# Altium project 单车驱动.PrjPcb
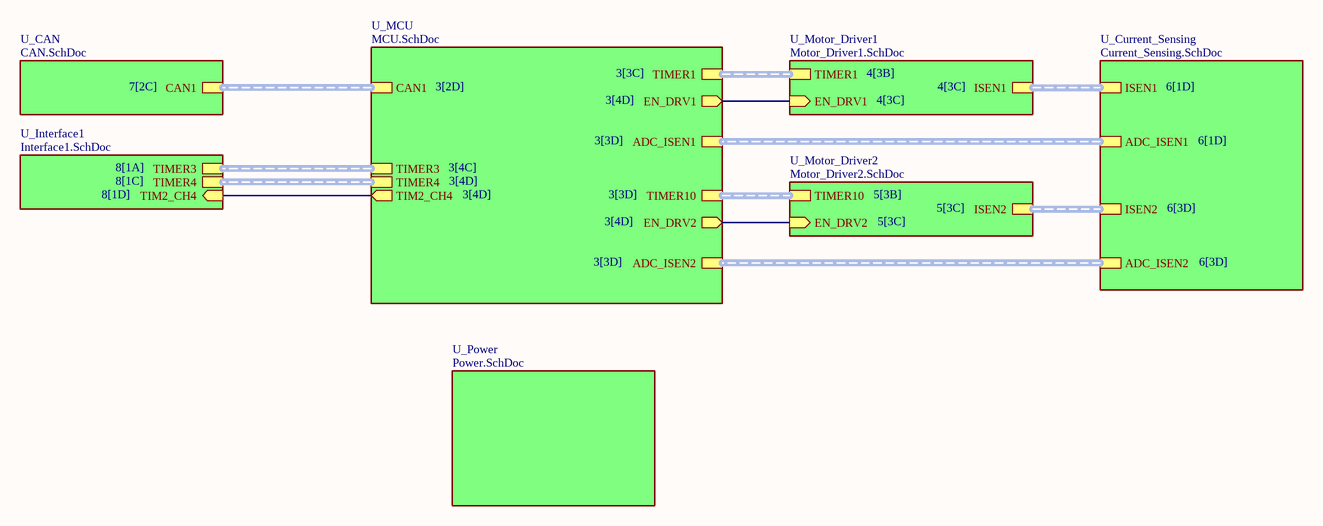
[diagram p0: Top_Level.SchDoc]
6 sheets, 175 parts. Net scope: hierarchical (ports join the sheet entries above them; power ports are global).
Board file: PCB1.PcbDoc
Sheets:
  Top_Level.SchDoc
    U_MCU = MCU.SchDoc
    U_CAN = CAN.SchDoc
    U_Current_Sensing = Current_Sensing.SchDoc
    U_Motor_Driver2 = Motor_Driver2.SchDoc
    U_Power = Power.SchDoc

## Sheet Top_Level.SchDoc
size A4; SheetNumber: 1; SheetTotal: 8

### Sub-sheets
U_CAN = CAN.SchDoc: CAN1 (harness CAN1)
U_Current_Sensing = Current_Sensing.SchDoc: ISEN1 (harness ISEN1), ISEN2 (harness ISEN2), ADC_ISEN1 (harness ADC_ISEN1), ADC_ISEN2 (harness ADC_ISEN2)
U_Interface1 = Interface1.SchDoc (file not in this document): TIMER4 (harness TIMER4), TIMER3 (harness TIMER3), TIM2_CH4 (in)
U_MCU = MCU.SchDoc: TIMER1 (harness TIMER1), TIMER10 (harness TIMER10), TIMER4 (harness TIMER4), TIMER3 (harness TIMER3), CAN1 (harness CAN1), ADC_ISEN1 (harness ADC_ISEN1), ADC_ISEN2 (harness ADC_ISEN2), TIM2_CH4 (out), EN_DRV1 (out), EN_DRV2 (out)
U_Motor_Driver1 = Motor_Driver1.SchDoc (file not in this document): TIMER1 (harness TIMER1), ISEN1 (harness ISEN1), EN_DRV1 (in)
U_Motor_Driver2 = Motor_Driver2.SchDoc: TIMER10 (harness TIMER10), ISEN2 (harness ISEN2), EN_DRV2 (in)
U_Power = Power.SchDoc: no entries

### Nets
EN_DRV1: sheet U_MCU/EN_DRV1, sheet U_Motor_Driver1/EN_DRV1
EN_DRV2: sheet U_MCU/EN_DRV2, sheet U_Motor_Driver2/EN_DRV2
TIM2_CH4: sheet U_MCU/TIM2_CH4, sheet U_Interface1/TIM2_CH4

### Buses and harness runs
harness sheet U_CAN/CAN1 = sheet U_MCU/CAN1
harness sheet U_Current_Sensing/ADC_ISEN1 = sheet U_MCU/ADC_ISEN1
harness sheet U_Current_Sensing/ADC_ISEN2 = sheet U_MCU/ADC_ISEN2
harness sheet U_Current_Sensing/ISEN1 = sheet U_Motor_Driver1/ISEN1
harness sheet U_Current_Sensing/ISEN2 = sheet U_Motor_Driver2/ISEN2
harness sheet U_Interface1/TIMER3 = sheet U_MCU/TIMER3
harness sheet U_Interface1/TIMER4 = sheet U_MCU/TIMER4
harness sheet U_MCU/TIMER1 = sheet U_Motor_Driver1/TIMER1
harness sheet U_MCU/TIMER10 = sheet U_Motor_Driver2/TIMER10

## Sheet MCU.SchDoc
size A4; SheetNumber: 3; SheetTotal: 8
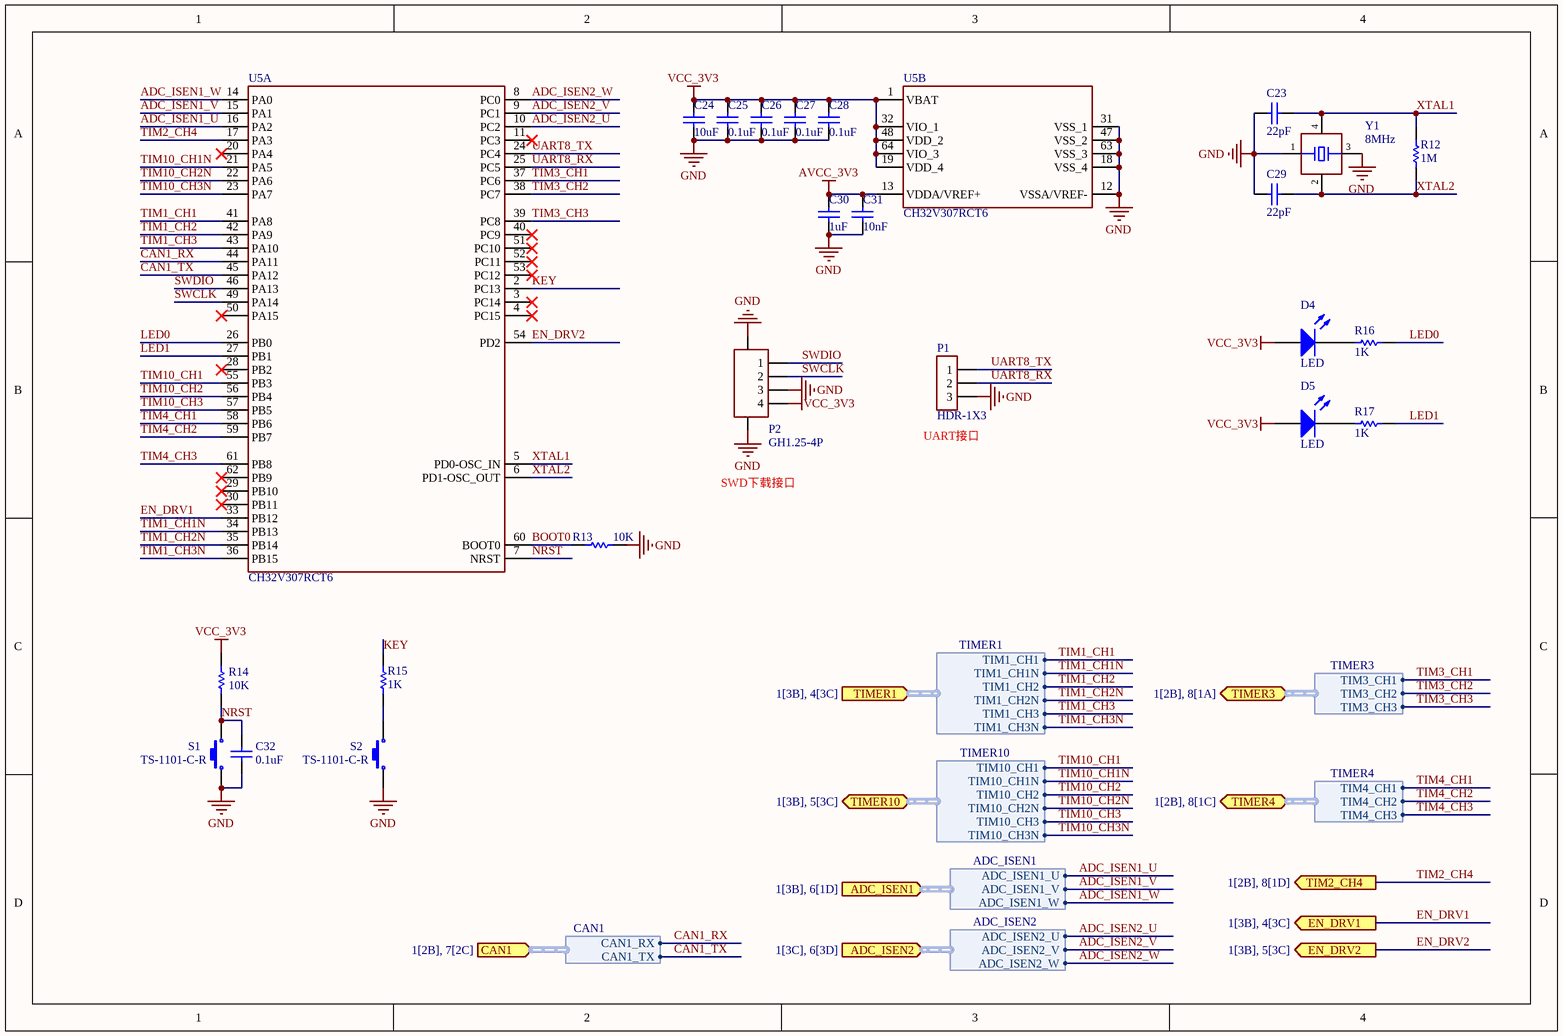
[diagram p1: MCU.SchDoc]

### Parts
C23  22pF  [C0603_NS]
C24  10uF  [C0603_NS]
C25  0.1uF  [C0603_NS]
C26  0.1uF  [C0603_NS]
C27  0.1uF  [C0603_NS]
C28  0.1uF  [C0603_NS]
C29  22pF  [C0603_NS]
C30  1uF  [C0603_NS]
C31  10nF  [C0603_NS]
C32  0.1uF  [C0603_NS]
D4  LED  [LED0603_NS]
D5  LED  [LED0603_NS]
P1  HDR-1X3  [HDR2.54-WI-3P]
P2  GH1.25-4P  [A1257WR-S-4P]
R12  1M  [R0603_NS]
R13  10K  [R0603_NS]
R14  10K  [R0603_NS]
R15  1K  [R0603_NS]
R16  1K  [R0603_NS]
R17  1K  [R0603_NS]
S1  TS-1101-C-R  [TS-1101]
S2  TS-1101-C-R  [TS-1101]
U5  CH32V307RCT6  [LQFP64_N]  (parts A,B of 2)
Y1  8MHz  [SMD-3225-4P]

### Ports
ADC_ISEN1 (in, harness ADC_ISEN1, see 1[3B], 6[1D]), ADC_ISEN2 (in, harness ADC_ISEN2, see 1[3C], 6[3D]), CAN1 (in, harness CAN1, see 1[2B], 7[2C]), EN_DRV1 (out, see 1[3B], 4[3C]), EN_DRV2 (out, see 1[3B], 5[3C]), TIM2_CH4 (out, see 1[2B], 8[1D]), TIMER1 (in, harness TIMER1, see 1[3B], 4[3C]), TIMER3 (bidir, harness TIMER3, see 1[2B], 8[1A]), TIMER4 (bidir, harness TIMER4, see 1[2B], 8[1C]), TIMER10 (bidir, harness TIMER10, see 1[3B], 5[3C])

### Harnesses
TIMER1: TIM1_CH1, TIM1_CH2, TIM1_CH3, TIM1_CH1N, TIM1_CH2N, TIM1_CH3N
TIMER10: TIM10_CH1N, TIM10_CH2N, TIM10_CH3N, TIM10_CH1, TIM10_CH2, TIM10_CH3
TIMER4: TIM4_CH1, TIM4_CH2, TIM4_CH3
TIMER3: TIM3_CH1, TIM3_CH2, TIM3_CH3
CAN1: CAN1_RX, CAN1_TX
ADC_ISEN1: ADC_ISEN1_W, ADC_ISEN1_V, ADC_ISEN1_U
ADC_ISEN2: ADC_ISEN2_W, ADC_ISEN2_V, ADC_ISEN2_U

### Nets
AVCC_3V3: C30.2 C31.2 U5.13(VDDA/VREF+)
GND: C23.1 C24.1 C25.1 C26.1 C27.1 C28.1 C29.1 C30.1 C31.1 C32.1 P1.3 P2.0 P2.3 R13.2 S1.1 S2.1 U5.12(VSSA/VREF-) U5.18(VSS_4) U5.31(VSS_1) U5.47(VSS_2) U5.63(VSS_3) Y1.1 Y1.3
VCC_3V3: C24.2 C25.2 C26.2 C27.2 C28.2 D4.1(A) D5.1(A) P2.4 R14.1 U5.1(VBAT) U5.19(VDD_4) U5.32(VIO_1) U5.48(VDD_2) U5.64(VIO_3)
ADC_ISEN1_U: U5.16(PA2) ; port ADC_ISEN1.ADC_ISEN1_U
ADC_ISEN1_V: U5.15(PA1) ; port ADC_ISEN1.ADC_ISEN1_V
ADC_ISEN1_W: U5.14(PA0) ; port ADC_ISEN1.ADC_ISEN1_W
ADC_ISEN2_U: U5.10(PC2) ; port ADC_ISEN2.ADC_ISEN2_U
ADC_ISEN2_V: U5.9(PC1) ; port ADC_ISEN2.ADC_ISEN2_V
ADC_ISEN2_W: U5.8(PC0) ; port ADC_ISEN2.ADC_ISEN2_W
BOOT0: R13.1 U5.60(BOOT0)
CAN1_RX: U5.44(PA11) ; port CAN1.CAN1_RX
CAN1_TX: U5.45(PA12) ; port CAN1.CAN1_TX
EN_DRV1: U5.33(PB12) ; port EN_DRV1
EN_DRV2: U5.54(PD2) ; port EN_DRV2
KEY: R15.2 U5.2(PC13)
LED0: R16.2 U5.26(PB0)
LED1: R17.2 U5.27(PB1)
NRST: C32.2 R14.2 S1.2 U5.7(NRST)
SWCLK: P2.2 U5.49(PA14)
SWDIO: P2.1 U5.46(PA13)
TIM1_CH1: U5.41(PA8) ; port TIMER1.TIM1_CH1
TIM1_CH1N: U5.34(PB13) ; port TIMER1.TIM1_CH1N
TIM1_CH2: U5.42(PA9) ; port TIMER1.TIM1_CH2
TIM1_CH2N: U5.35(PB14) ; port TIMER1.TIM1_CH2N
TIM1_CH3: U5.43(PA10) ; port TIMER1.TIM1_CH3
TIM1_CH3N: U5.36(PB15) ; port TIMER1.TIM1_CH3N
TIM2_CH4: U5.17(PA3) ; port TIM2_CH4
TIM3_CH1: U5.37(PC6) ; port TIMER3.TIM3_CH1
TIM3_CH2: U5.38(PC7) ; port TIMER3.TIM3_CH2
TIM3_CH3: U5.39(PC8) ; port TIMER3.TIM3_CH3
TIM4_CH1: U5.58(PB6) ; port TIMER4.TIM4_CH1
TIM4_CH2: U5.59(PB7) ; port TIMER4.TIM4_CH2
TIM4_CH3: U5.61(PB8) ; port TIMER4.TIM4_CH3
TIM10_CH1: U5.55(PB3) ; port TIMER10.TIM10_CH1
TIM10_CH1N: U5.21(PA5) ; port TIMER10.TIM10_CH1N
TIM10_CH2: U5.56(PB4) ; port TIMER10.TIM10_CH2
TIM10_CH2N: U5.22(PA6) ; port TIMER10.TIM10_CH2N
TIM10_CH3: U5.57(PB5) ; port TIMER10.TIM10_CH3
TIM10_CH3N: U5.23(PA7) ; port TIMER10.TIM10_CH3N
UART8_RX: P1.2 U5.25(PC5)
UART8_TX: P1.1 U5.24(PC4)
XTAL1: C23.2 R12.2 U5.5(PD0-OSC_IN) Y1.4
XTAL2: C29.2 R12.1 U5.6(PD1-OSC_OUT) Y1.2
NetD4_2: D4.2(K) R16.1
NetD5_2: D5.2(K) R17.1
NetR15_1: R15.1 S2.2

Not connected (* = marked no-connect by the designer): U5 3(PC14)* 4(PC15)* 11(PC3)* 20(PA4)* 28(PB2)* 29(PB10)* 30(PB11)* 40(PC9)* 50(PA15)* 51(PC10)* 52(PC11)* 53(PC12)* 62(PB9)*

### Notes on the sheet
- (near P1) UART接口
- SWD下载接口

### Library data of the parts
C23-C32 = Cap: Capacitor
  C23 C29: Published: 8-Jun-2000; LatestRevisionDate: 17-Jul-2002; LatestRevisionNote: Re-released for DXP Platform.; PackageReference: RAD-0.3; Publisher: Altium Limited; PackageDescription: Radial Cap, Thru-Hole; 2 Leads; 0.3 in Pin Spacing; Value: 22pF
D4 D5 = LED0: Typical INFRARED GaAs LED
P2 = Header4
R12-R17 = Res1: Resistor
S1 S2 = SW
Y1 = XTAL

## Sheet CAN.SchDoc
size A4; SheetNumber: 7; SheetTotal: 8
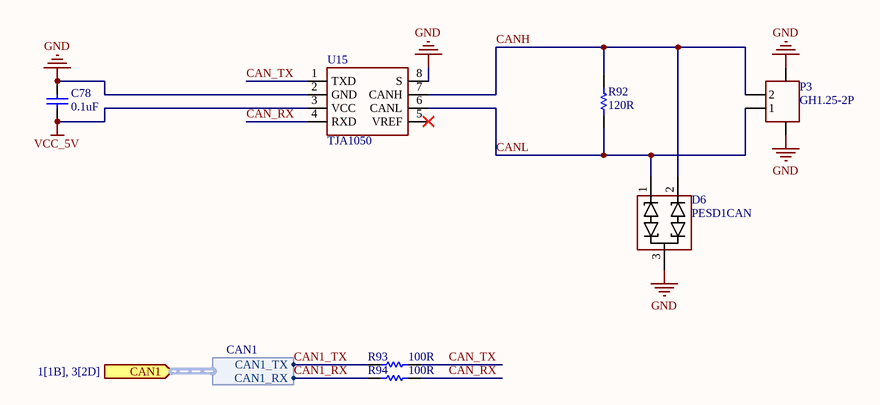
[diagram p2: CAN.SchDoc]

### Parts
C78  0.1uF  [C0603_NS]
D6  PESD1CAN  [SOT23-3N]
P3  GH1.25-2P  [A1257WR-S-2P]
R92  120R  [R0603_NS]
R93  100R  [R0603_NS]
R94  100R  [R0603_NS]
U15  TJA1050  [SOP8_N]

### Ports
CAN1 (in, harness CAN1, see 1[1B], 3[2D])

### Harnesses
CAN1: CAN1_RX, CAN1_TX

### Nets
GND: C78.2 D6.3 P3.0 U15.2(GND) U15.8(S)
VCC_5V: C78.1 U15.3(VCC)
CAN1_RX: R94.1 ; port CAN1.CAN1_RX
CAN1_TX: R93.1 ; port CAN1.CAN1_TX
CAN_RX: R94.2 U15.4(RXD)
CAN_TX: R93.2 U15.1(TXD)
CANH: D6.2 P3.2 R92.2 U15.7(CANH)
CANL: D6.1 P3.1 R92.1 U15.6(CANL)

Not connected (* = marked no-connect by the designer): U15 5(VREF)*

### Library data of the parts
C78 = Cap: Capacitor
P3 = Header2
R92-R94 = Res1: Resistor

## Sheet Current_Sensing.SchDoc
size A4; SheetNumber: 6; SheetTotal: 8
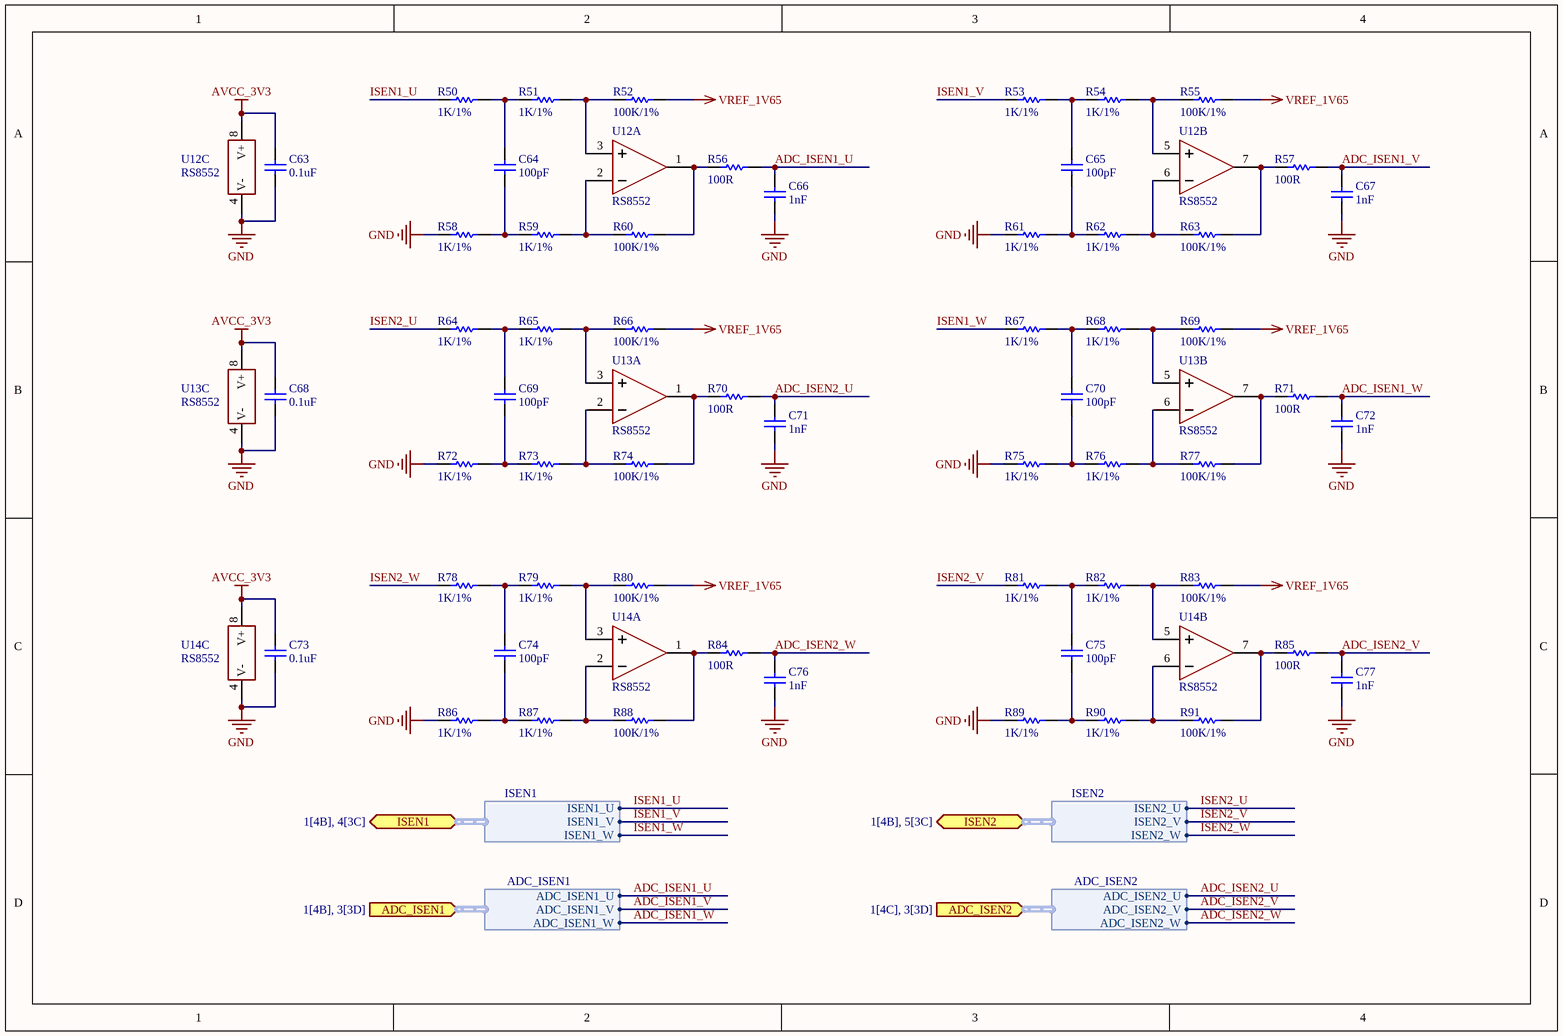
[diagram p3: Current_Sensing.SchDoc]

### Parts
C63  0.1uF  [C0603_NS]
C64  100pF  [C0603_NS]
C65  100pF  [C0603_NS]
C66  1nF  [C0603_NS]
C67  1nF  [C0603_NS]
C68  0.1uF  [C0603_NS]
C69  100pF  [C0603_NS]
C70  100pF  [C0603_NS]
C71  1nF  [C0603_NS]
C72  1nF  [C0603_NS]
C73  0.1uF  [C0603_NS]
C74  100pF  [C0603_NS]
C75  100pF  [C0603_NS]
C76  1nF  [C0603_NS]
C77  1nF  [C0603_NS]
R50  1K/1%  [R0603_NS]
R51  1K/1%  [R0603_NS]
R52  100K/1%  [R0603_NS]
R53  1K/1%  [R0603_NS]
R54  1K/1%  [R0603_NS]
R55  100K/1%  [R0603_NS]
R56  100R  [R0603_NS]
R57  100R  [R0603_NS]
R58  1K/1%  [R0603_NS]
R59  1K/1%  [R0603_NS]
R60  100K/1%  [R0603_NS]
R61  1K/1%  [R0603_NS]
R62  1K/1%  [R0603_NS]
R63  100K/1%  [R0603_NS]
R64  1K/1%  [R0603_NS]
R65  1K/1%  [R0603_NS]
R66  100K/1%  [R0603_NS]
R67  1K/1%  [R0603_NS]
R68  1K/1%  [R0603_NS]
R69  100K/1%  [R0603_NS]
R70  100R  [R0603_NS]
R71  100R  [R0603_NS]
R72  1K/1%  [R0603_NS]
R73  1K/1%  [R0603_NS]
R74  100K/1%  [R0603_NS]
R75  1K/1%  [R0603_NS]
R76  1K/1%  [R0603_NS]
R77  100K/1%  [R0603_NS]
R78  1K/1%  [R0603_NS]
R79  1K/1%  [R0603_NS]
R80  100K/1%  [R0603_NS]
R81  1K/1%  [R0603_NS]
R82  1K/1%  [R0603_NS]
R83  100K/1%  [R0603_NS]
R84  100R  [R0603_NS]
R85  100R  [R0603_NS]
R86  1K/1%  [R0603_NS]
R87  1K/1%  [R0603_NS]
R88  100K/1%  [R0603_NS]
R89  1K/1%  [R0603_NS]
R90  1K/1%  [R0603_NS]
R91  100K/1%  [R0603_NS]
U12  RS8552  [TSSOP8_N]  (parts A,B,C of 3)
U13  RS8552  [TSSOP8_N]  (parts A,B,C of 3)
U14  RS8552  [TSSOP8_N]  (parts A,B,C of 3)

### Ports
ADC_ISEN1 (in, harness ADC_ISEN1, see 1[4B], 3[3D]), ADC_ISEN2 (in, harness ADC_ISEN2, see 1[4C], 3[3D]), ISEN1 (bidir, harness ISEN1, see 1[4B], 4[3C]), ISEN2 (bidir, harness ISEN2, see 1[4B], 5[3C])

### Harnesses
ISEN1: ISEN1_U, ISEN1_V, ISEN1_W
ISEN2: ISEN2_U, ISEN2_V, ISEN2_W
ADC_ISEN1: ADC_ISEN1_W, ADC_ISEN1_V, ADC_ISEN1_U
ADC_ISEN2: ADC_ISEN2_W, ADC_ISEN2_V, ADC_ISEN2_U

### Nets
AVCC_3V3: C63.2 C68.2 C73.2 U12.8(V+) U13.8(V+) U14.8(V+)
GND: C63.1 C66.1 C67.1 C68.1 C71.1 C72.1 C73.1 C76.1 C77.1 R58.1 R61.1 R72.1 R75.1 R86.1 R89.1 U12.4(V-) U13.4(V-) U14.4(V-)
VREF_1V65: R52.2 R55.2 R66.2 R69.2 R80.2 R83.2
ADC_ISEN1_U: C66.2 R56.2 ; port ADC_ISEN1.ADC_ISEN1_U
ADC_ISEN1_V: C67.2 R57.2 ; port ADC_ISEN1.ADC_ISEN1_V
ADC_ISEN1_W: C72.2 R71.2 ; port ADC_ISEN1.ADC_ISEN1_W
ADC_ISEN2_U: C71.2 R70.2 ; port ADC_ISEN2.ADC_ISEN2_U
ADC_ISEN2_V: C77.2 R85.2 ; port ADC_ISEN2.ADC_ISEN2_V
ADC_ISEN2_W: C76.2 R84.2 ; port ADC_ISEN2.ADC_ISEN2_W
ISEN1_U: R50.1 ; port ISEN1.ISEN1_U
ISEN1_V: R53.1 ; port ISEN1.ISEN1_V
ISEN1_W: R67.1 ; port ISEN1.ISEN1_W
ISEN2_U: R64.1 ; port ISEN2.ISEN2_U
ISEN2_V: R81.1 ; port ISEN2.ISEN2_V
ISEN2_W: R78.1 ; port ISEN2.ISEN2_W
NetC64_1: C64.1 R58.2 R59.1
NetC64_2: C64.2 R50.2 R51.1
NetC65_1: C65.1 R61.2 R62.1
NetC65_2: C65.2 R53.2 R54.1
NetC69_1: C69.1 R72.2 R73.1
NetC69_2: C69.2 R64.2 R65.1
NetC70_1: C70.1 R75.2 R76.1
NetC70_2: C70.2 R67.2 R68.1
NetC74_1: C74.1 R86.2 R87.1
NetC74_2: C74.2 R78.2 R79.1
NetC75_1: C75.1 R89.2 R90.1
NetC75_2: C75.2 R81.2 R82.1
NetR51_2: R51.2 R52.1 U12.3(+IN_A)
NetR54_2: R54.2 R55.1 U12.5(+IN_B)
NetR56_1: R56.1 R60.2 U12.1(OUT_A)
NetR57_1: R57.1 R63.2 U12.7(OUT_B)
NetR59_2: R59.2 R60.1 U12.2(-IN_A)
NetR62_2: R62.2 R63.1 U12.6(-IN_B)
NetR65_2: R65.2 R66.1 U13.3(+IN_A)
NetR68_2: R68.2 R69.1 U13.5(+IN_B)
NetR70_1: R70.1 R74.2 U13.1(OUT_A)
NetR71_1: R71.1 R77.2 U13.7(OUT_B)
NetR73_2: R73.2 R74.1 U13.2(-IN_A)
NetR76_2: R76.2 R77.1 U13.6(-IN_B)
NetR79_2: R79.2 R80.1 U14.3(+IN_A)
NetR82_2: R82.2 R83.1 U14.5(+IN_B)
NetR84_1: R84.1 R88.2 U14.1(OUT_A)
NetR85_1: R85.1 R91.2 U14.7(OUT_B)
NetR87_2: R87.2 R88.1 U14.2(-IN_A)
NetR90_2: R90.2 R91.1 U14.6(-IN_B)

### Library data of the parts
C63-C77 = Cap: Capacitor
R50-R91 = Res1: Resistor
U12-U14 = AD8606

## Sheet Motor_Driver2.SchDoc
size A4; SheetNumber: 5; SheetTotal: 8
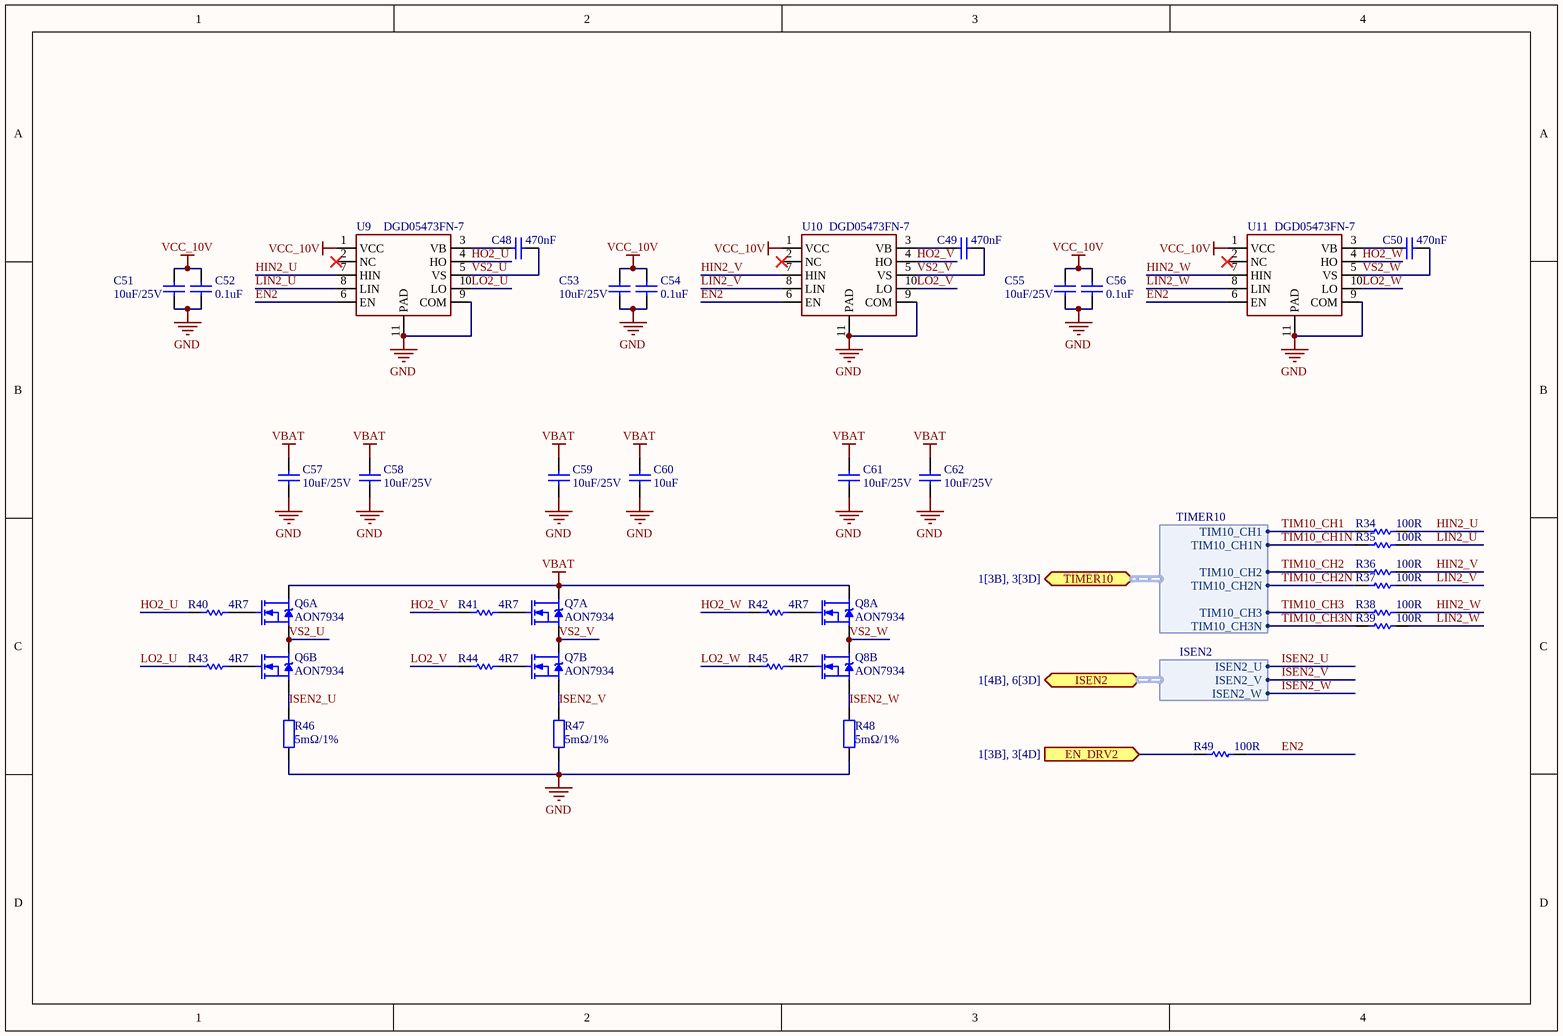
[diagram p4: Motor_Driver2.SchDoc]

### Parts
C48  470nF  [C0603_NS]
C49  470nF  [C0603_NS]
C50  470nF  [C0603_NS]
C51  10uF/25V  [C0603_NS]
C52  0.1uF  [C0603_NS]
C53  10uF/25V  [C0603_NS]
C54  0.1uF  [C0603_NS]
C55  10uF/25V  [C0603_NS]
C56  0.1uF  [C0603_NS]
C57  10uF/25V  [C0603_NS]
C58  10uF/25V  [C0603_NS]
C59  10uF/25V  [C0603_NS]
C60  10uF  [C0603_NS]
C61  10uF/25V  [C0603_NS]
C62  10uF/25V  [C0603_NS]
Q6  AON7934  [POWERPAIR_3X3]  (parts A,B of 2)
Q7  AON7934  [POWERPAIR_3X3]  (parts A,B of 2)
Q8  AON7934  [POWERPAIR_3X3]  (parts A,B of 2)
R34  100R  [R0603_NS]
R35  100R  [R0603_NS]
R36  100R  [R0603_NS]
R37  100R  [R0603_NS]
R38  100R  [R0603_NS]
R39  100R  [R0603_NS]
R40  4R7  [R0603_NS]
R41  4R7  [R0603_NS]
R42  4R7  [R0603_NS]
R43  4R7  [R0603_NS]
R44  4R7  [R0603_NS]
R45  4R7  [R0603_NS]
R46  5mΩ/1%  [R1206_NS]
R47  5mΩ/1%  [R1206_NS]
R48  5mΩ/1%  [R1206_NS]
R49  100R  [R0603_NS]
U9  DGD05473FN-7  [W-DFN3030-10_DGD05473]
U10  DGD05473FN-7  [W-DFN3030-10_DGD05473]
U11  DGD05473FN-7  [W-DFN3030-10_DGD05473]

### Ports
EN_DRV2 (in, see 1[3B], 3[4D]), ISEN2 (bidir, harness ISEN2, see 1[4B], 6[3D]), TIMER10 (bidir, harness TIMER10, see 1[3B], 3[3D])

### Harnesses
TIMER10: TIM10_CH1N, TIM10_CH2N, TIM10_CH3N, TIM10_CH1, TIM10_CH2, TIM10_CH3
ISEN2: ISEN2_U, ISEN2_V, ISEN2_W

### Nets
GND: C51.2 C52.2 C53.2 C54.2 C55.2 C56.2 C57.1 C58.1 C59.1 C60.1 C61.1 C62.1 R46.1 R47.1 R48.1 U9.9(COM) U9.11(PAD) U10.9(COM) U10.11(PAD) U11.9(COM) U11.11(PAD)
VBAT: C57.2 C58.2 C59.2 C60.2 C61.2 C62.2 Q6.D1 Q7.D1 Q8.D1
VCC_10V: C51.1 C52.1 C53.1 C54.1 C55.1 C56.1 U9.1(VCC) U10.1(VCC) U11.1(VCC)
EN2: R49.2 U9.6(EN) U10.6(EN) U11.6(EN)
EN_DRV2: R49.1 ; port EN_DRV2
HIN2_U: R34.2 U9.7(HIN)
HIN2_V: R36.2 U10.7(HIN)
HIN2_W: R38.2 U11.7(HIN)
HO2_U: R40.1 U9.4(HO)
HO2_V: R41.1 U10.4(HO)
HO2_W: R42.1 U11.4(HO)
ISEN2_U: Q6.S2 R46.2 ; port ISEN2.ISEN2_U
ISEN2_V: Q7.S2 R47.2 ; port ISEN2.ISEN2_V
ISEN2_W: Q8.S2 R48.2 ; port ISEN2.ISEN2_W
LIN2_U: R35.2 U9.8(LIN)
LIN2_V: R37.2 U10.8(LIN)
LIN2_W: R39.2 U11.8(LIN)
LO2_U: R43.1 U9.10(LO)
LO2_V: R44.1 U10.10(LO)
LO2_W: R45.1 U11.10(LO)
TIM10_CH1: R34.1 ; port TIMER10.TIM10_CH1
TIM10_CH1N: R35.1 ; port TIMER10.TIM10_CH1N
TIM10_CH2: R36.1 ; port TIMER10.TIM10_CH2
TIM10_CH2N: R37.1 ; port TIMER10.TIM10_CH2N
TIM10_CH3: R38.1 ; port TIMER10.TIM10_CH3
TIM10_CH3N: R39.1 ; port TIMER10.TIM10_CH3N
VS2_U: C48.2 Q6.S1/D2 U9.5(VS)
VS2_V: C49.2 Q7.S1/D2 U10.5(VS)
VS2_W: C50.2 Q8.S1/D2 U11.5(VS)
NetC48_1: C48.1 U9.3(VB)
NetC49_1: C49.1 U10.3(VB)
NetC50_1: C50.1 U11.3(VB)
NetQ6_G1: Q6.G1 R40.2
NetQ6_G2: Q6.G2 R43.2
NetQ7_G1: Q7.G1 R41.2
NetQ7_G2: Q7.G2 R44.2
NetQ8_G1: Q8.G1 R42.2
NetQ8_G2: Q8.G2 R45.2

Not connected (* = marked no-connect by the designer): U9 2(NC)*; U10 2(NC)*; U11 2(NC)*

### Library data of the parts
C48-C56 = Cap: Capacitor; Value: 1uF; Published: 8-Jun-2000; LatestRevisionDate: 17-Jul-2002; LatestRevisionNote: Re-released for DXP Platform.; PackageReference: RAD-0.3; Publisher: Altium Limited; PackageDescription: Radial Cap, Thru-Hole; 2 Leads; 0.3 in Pin Spacing
C57-C62 = Cap: Capacitor
R34-R45 R49 = Res1: Resistor
R46-R48 = Res2: Resistor; Value: 15mΩ; Published: 8-Jun-2000; LatestRevisionDate: 17-Jul-2002; LatestRevisionNote: Re-released for DXP Platform.; PackageReference: AXIAL-0.4; Publisher: Altium Limited; PackageDescription: Axial Device, Thru-Hole; 2 Leads; 0.4 in Pin Spacing
U9-U11 = DGD05473

## Sheet Power.SchDoc
size A4; SheetNumber: 2; SheetTotal: 8
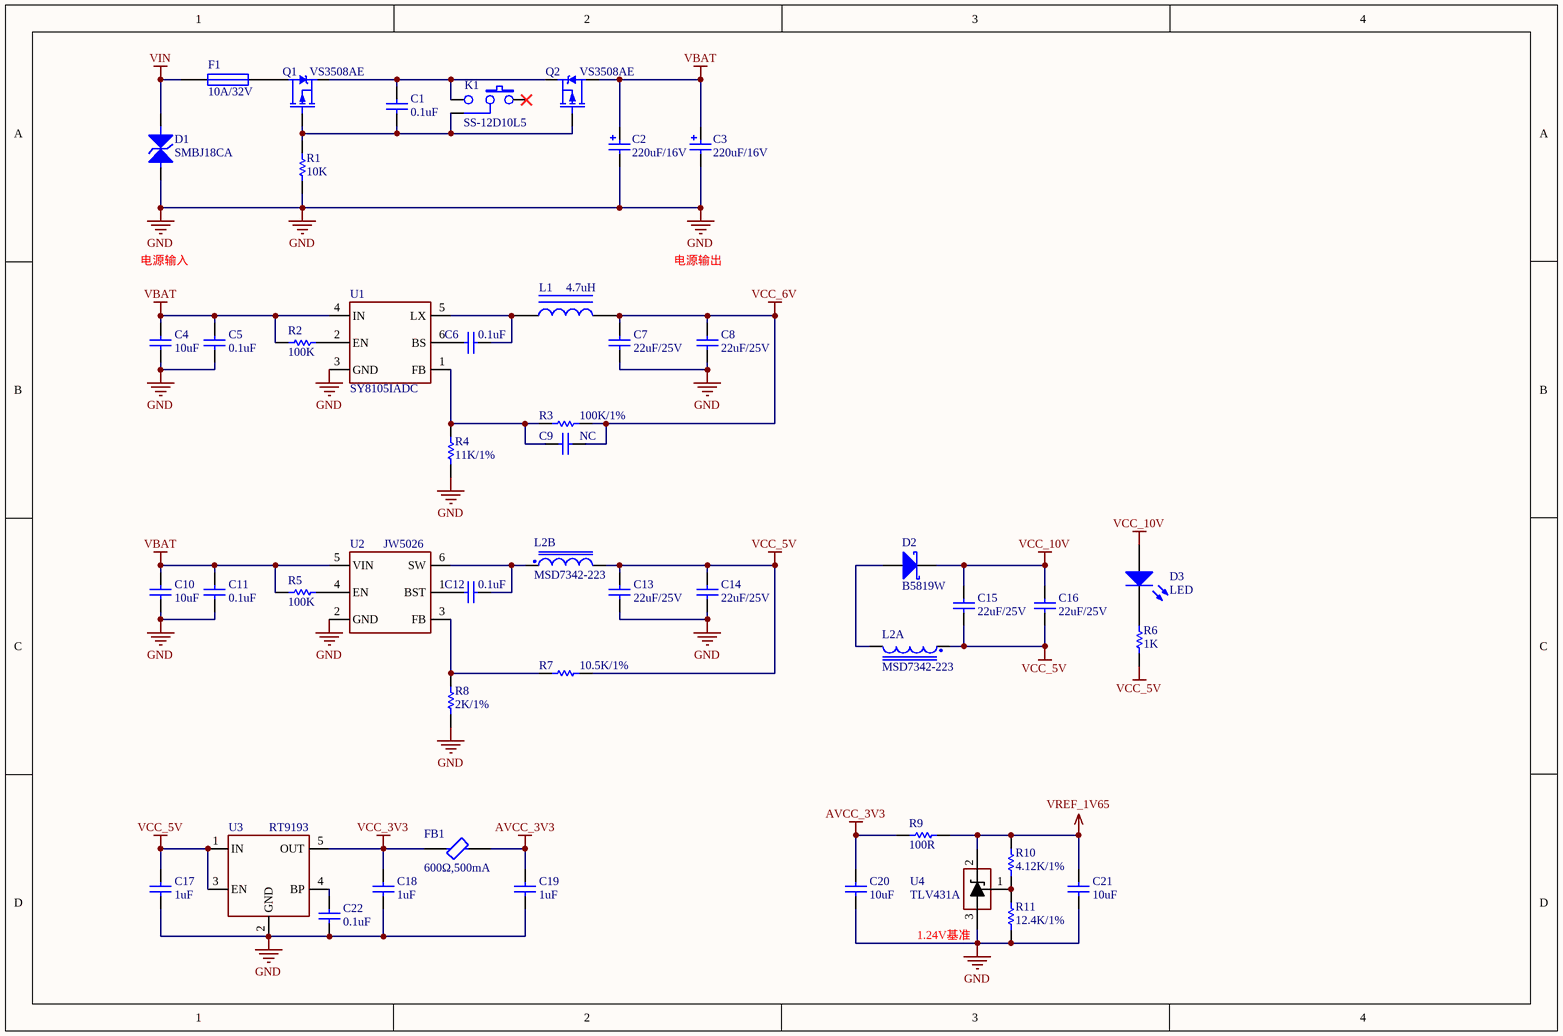
[diagram p5: Power.SchDoc]

### Parts
C1  0.1uF  [C0603_NS]
C2  220uF/16V  [CT 2.5*6.3*7 - R]
C3  220uF/16V  [CT 2.5*6.3*7 - R]
C4  10uF  [C0603_NS]
C5  0.1uF  [C0603_NS]
C6  0.1uF  [C0603_NS]
C7  22uF/25V  [C0805_NS]
C8  22uF/25V  [C0805_NS]
C9  NC  [C0603_NS]
C10  10uF  [C0603_NS]
C11  0.1uF  [C0603_NS]
C12  0.1uF  [C0603_NS]
C13  22uF/25V  [C0805_NS]
C14  22uF/25V  [C0805_NS]
C15  22uF/25V  [C0805_NS]
C16  22uF/25V  [C0805_NS]
C17  1uF  [C0603_NS]
C18  1uF  [C0603_NS]
C19  1uF  [C0603_NS]
C20  10uF  [C0603_NS]
C21  10uF  [C0603_NS]
C22  0.1uF  [C0603_NS]
D1  SMBJ18CA  [SMB]
D2  B5819W  [SOD-123]
D3  LED  [LED0603_NS]
F1  10A/32V  [FU 1206]
FB1  600Ω,500mA  [FB0603_NS]
K1  SS-12D10L5  [SS-12D10]
L1  4.7uH  [L-SMD-0630]
L2  MSD7342-223  [MSD7342]  (parts A,B of 2)
Q1  VS3508AE  [PowerPAK1212-8]
Q2  VS3508AE  [PowerPAK1212-8]
R1  10K  [R0603_NS]
R2  100K  [R0603_NS]
R3  100K/1%  [R0603_NS]
R4  11K/1%  [R0603_NS]
R5  100K  [R0603_NS]
R6  1K  [R0603_NS]
R7  10.5K/1%  [R0603_NS]
R8  2K/1%  [R0603_NS]
R9  100R  [R0603_NS]
R10  4.12K/1%  [R0603_NS]
R11  12.4K/1%  [R0603_NS]
U1  SY8105IADC  [SOT23-6N]
U2  JW5026  [SOT23-6N]
U3  RT9193  [SOT23-5N]
U4  TLV431A  [SOT23-3N]

### Nets
AVCC_3V3: C19.2 C20.2 FB1.2 R9.2
GND: C2.2 C3.2 C4.1 C5.1 C7.1 C8.1 C10.1 C11.1 C13.1 C14.1 C17.1 C18.1 C19.1 C20.1 C21.1 C22.1 D1.A R1.2 R4.2 R8.2 R11.1 U1.3(GND) U2.2(GND) U3.2(GND) U4.3(ANODE)
VBAT: C2.1 C3.1 C4.2 C5.2 C10.2 C11.2 Q2.D R2.2 R5.2 U1.4(IN) U2.5(VIN)
VCC_3V3: C18.2 FB1.1 U3.5(OUT)
VCC_5V: C13.2 C14.2 C15.1 C16.1 C17.2 L2.1 L2.4 R6.2 R7.2 U3.1(IN) U3.3(EN)
VCC_6V: C7.2 C8.2 C9.2 L1.2 R3.2
VCC_10V: C15.2 C16.2 D2.2(K) D3.1(A)
VIN: D1.K F1.1
VREF_1V65: C21.2 R9.1 R10.1 U4.2(CATHODE)
NetC1_1: C1.1 K1.2 Q1.S Q2.S
NetC1_2: C1.2 K1.1 Q1.G Q2.G R1.1
NetC6_1: C6.1 U1.6(BS)
NetC6_2: C6.2 L1.1 U1.5(LX)
NetC9_1: C9.1 R3.1 R4.1 U1.1(FB)
NetC12_1: C12.1 U2.1(BST)
NetC12_2: C12.2 L2.2 U2.6(SW)
NetC22_2: C22.2 U3.4(BP)
NetD2_1: D2.1(A) L2.3
NetD3_2: D3.2(K) R6.1
NetF1_2: F1.2 Q1.D
NetR2_1: R2.1 U1.2(EN)
NetR5_1: R5.1 U2.4(EN)
NetR7_1: R7.1 R8.1 U2.3(FB)
NetR10_2: R10.2 R11.2 U4.1(REF)

Not connected (* = marked no-connect by the designer): K1 3*

### Notes on the sheet
- 电源输入
- 电源输出
- (near U4) 1.24V基准

### Library data of the parts
C1 C4-C22 = Cap: Capacitor
C2 C3 = Cap Pol2: Polarized Capacitor (Axial); Published: 8-Jun-2000; LatestRevisionDate: 17-Jul-2002; LatestRevisionNote: Re-released for DXP Platform.; Publisher: Altium Limited; PackageDescription: Polarized Capacitor; 2 Leads
D1 = TVS: 双向瞬态抑制二极管; pin to pad: A>1 K>2
D2 = D Schottky: Schottky Diode; Published: 8-Jun-2000; LatestRevisionDate: 17-Jul-2002; LatestRevisionNote: Re-released for DXP Platform.; PackageReference: SMB; Publisher: Altium Limited; PackageDescription: DO-214-AA/SMB; 2 C-Bend Leads; Body 5.3 x 3.6 mm, inc. leads (LxW); Code_JEDEC: DO-214-AA
D3 = LED0: Typical INFRARED GaAs LED
F1 = Fuse 1: Fuse; Published: 8-Jun-2000; LatestRevisionDate: 17-Jul-2002; LatestRevisionNote: Re-released for DXP Platform.; PackageReference: PIN-W2/E2.8; Publisher: Altium Limited; PackageDescription: Thru-Hole; 2 Leads
FB1 = Ferrite Bead
K1 = SW2: Right: *; Bottom: *
L1 = Inductor Iron: Magnetic-Core Inductor
L2 = Coupled Inductor
Q1 Q2 = P-MOS: P沟道场效应管
R1-R11 = Res1: Resistor
U1 = SY8105
U4 = TLV431DBZ

## Nets that join several sheets
AVCC_3V3: MCU (C30.2 C31.2 U5.13), Current_Sensing (6 pins), Power (C19.2 C20.2 FB1.2 R9.2)
GND: MCU (23 pins), CAN (5 pins), Current_Sensing (18 pins), Motor_Driver2 (21 pins), Power (25 pins)
VBAT: Motor_Driver2 (9 pins), Power (11 pins)
VCC_3V3: MCU (14 pins), Power (C18.2 FB1.1 U3.5)
VCC_5V: CAN (C78.1 U15.3), Power (11 pins)
VCC_10V: Motor_Driver2 (9 pins), Power (C15.2 C16.2 D2.2 D3.1)
VREF_1V65: Current_Sensing (6 pins), Power (C21.2 R9.1 R10.1 U4.2)
ADC_ISEN1_U: MCU (U5.16), Current_Sensing (C66.2 R56.2)
ADC_ISEN1_V: MCU (U5.15), Current_Sensing (C67.2 R57.2)
ADC_ISEN1_W: MCU (U5.14), Current_Sensing (C72.2 R71.2)
ADC_ISEN2_U: MCU (U5.10), Current_Sensing (C71.2 R70.2)
ADC_ISEN2_V: MCU (U5.9), Current_Sensing (C77.2 R85.2)
ADC_ISEN2_W: MCU (U5.8), Current_Sensing (C76.2 R84.2)
CAN1_RX: MCU (U5.44), CAN (R94.1)
CAN1_TX: MCU (U5.45), CAN (R93.1)
EN_DRV2: MCU (U5.54), Motor_Driver2 (R49.1)
ISEN2_U: Current_Sensing (R64.1), Motor_Driver2 (Q6.S2 R46.2)
ISEN2_V: Current_Sensing (R81.1), Motor_Driver2 (Q7.S2 R47.2)
ISEN2_W: Current_Sensing (R78.1), Motor_Driver2 (Q8.S2 R48.2)
TIM10_CH1: MCU (U5.55), Motor_Driver2 (R34.1)
TIM10_CH1N: MCU (U5.21), Motor_Driver2 (R35.1)
TIM10_CH2: MCU (U5.56), Motor_Driver2 (R36.1)
TIM10_CH2N: MCU (U5.22), Motor_Driver2 (R37.1)
TIM10_CH3: MCU (U5.57), Motor_Driver2 (R38.1)
TIM10_CH3N: MCU (U5.23), Motor_Driver2 (R39.1)